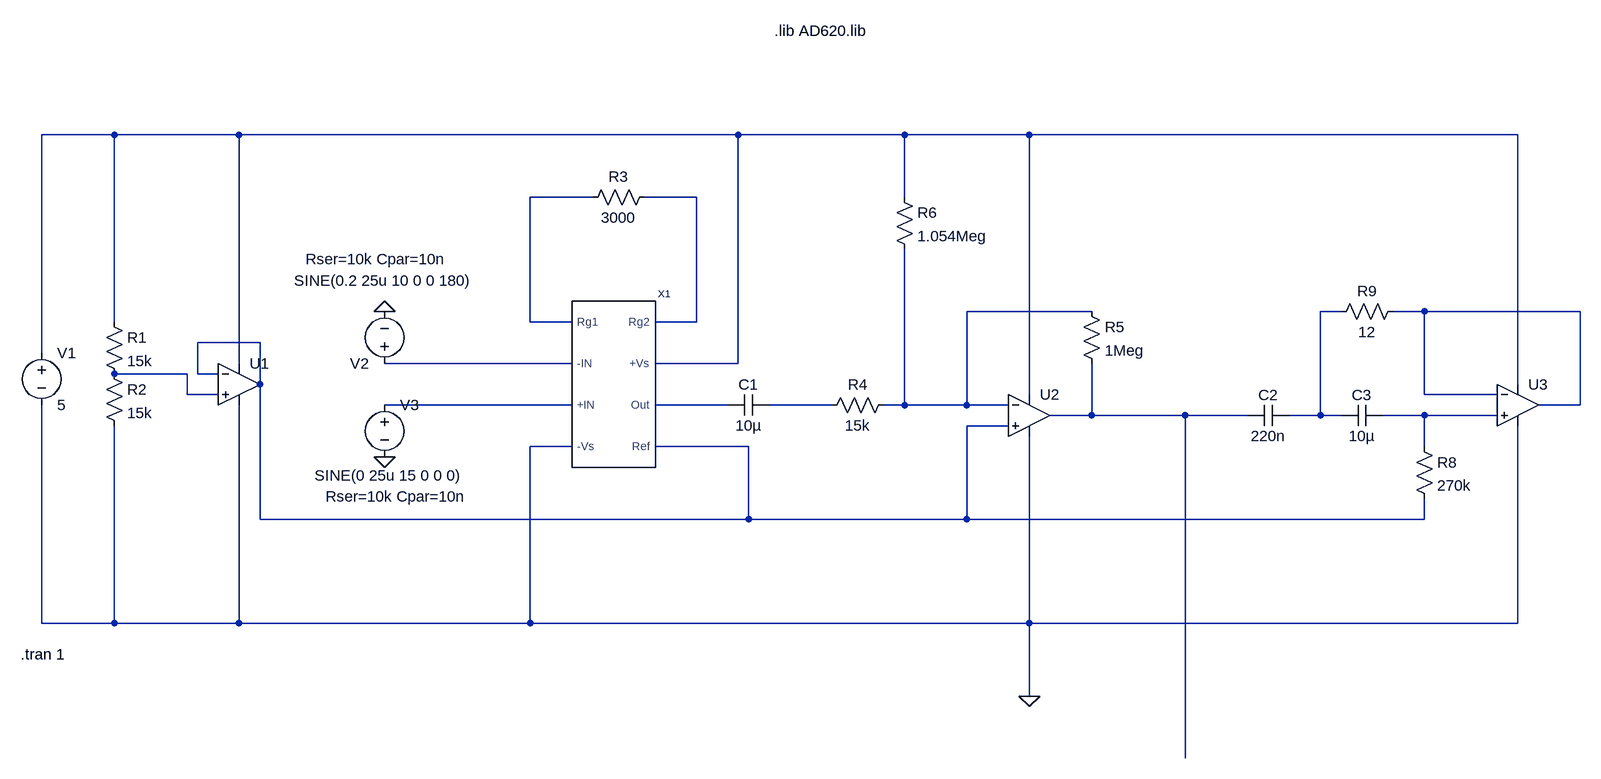
[diagram p0: schematic EEG.asc]
EEG.asc, the LTspice schematic file:
Version 4.1
SHEET 1 2612 752
WIRE 48 -240 -64 -240
WIRE 240 -240 48 -240
WIRE 1008 -240 240 -240
WIRE 1264 -240 1008 -240
WIRE 1456 -240 1264 -240
WIRE 2208 -240 1456 -240
WIRE 784 -144 688 -144
WIRE 944 -144 864 -144
WIRE 1264 -144 1264 -240
WIRE 1552 32 1360 32
WIRE 1936 32 1904 32
WIRE 2064 32 2016 32
WIRE 2304 32 2064 32
WIRE 48 48 48 -240
WIRE 688 48 688 -144
WIRE 752 48 688 48
WIRE 944 48 944 -144
WIRE 944 48 880 48
WIRE 272 80 176 80
WIRE -64 96 -64 -240
WIRE 240 112 240 -240
WIRE 752 112 464 112
WIRE 1008 112 1008 -240
WIRE 1008 112 880 112
WIRE 160 128 48 128
WIRE 176 128 176 80
WIRE 208 128 176 128
WIRE 272 144 272 80
WIRE 2208 144 2208 -240
WIRE 160 160 160 128
WIRE 208 160 160 160
WIRE 1456 160 1456 -240
WIRE 2064 160 2064 32
WIRE 2176 160 2064 160
WIRE 752 176 464 176
WIRE 992 176 880 176
WIRE 1152 176 1056 176
WIRE 1264 176 1264 -64
WIRE 1264 176 1232 176
WIRE 1360 176 1360 32
WIRE 1360 176 1264 176
WIRE 1424 176 1360 176
WIRE 2304 176 2304 32
WIRE 2304 176 2240 176
WIRE 1552 192 1552 112
WIRE 1552 192 1488 192
WIRE 1696 192 1552 192
WIRE 1792 192 1696 192
WIRE 1904 192 1904 32
WIRE 1904 192 1856 192
WIRE 1936 192 1904 192
WIRE 2064 192 2000 192
WIRE 2176 192 2064 192
WIRE 1424 208 1360 208
WIRE 752 240 688 240
WIRE 1024 240 880 240
WIRE 2064 240 2064 192
WIRE 272 352 272 144
WIRE 1024 352 1024 240
WIRE 1024 352 272 352
WIRE 1360 352 1360 208
WIRE 1360 352 1024 352
WIRE 2064 352 2064 320
WIRE 2064 352 1360 352
WIRE -64 512 -64 176
WIRE 48 512 48 208
WIRE 48 512 -64 512
WIRE 240 512 240 176
WIRE 240 512 48 512
WIRE 688 512 688 240
WIRE 688 512 240 512
WIRE 1456 512 1456 224
WIRE 1456 512 688 512
WIRE 2208 512 2208 208
WIRE 2208 512 1456 512
WIRE 1456 624 1456 512
WIRE 1696 720 1696 192
FLAG 464 32 0
FLAG 464 256 0
FLAG 1456 624 0
SYMBOL res 32 32 R0
SYMATTR InstName R1
SYMATTR Value 15k
SYMBOL res 32 112 R0
SYMATTR InstName R2
SYMATTR Value 15k
SYMBOL OpAmps\\UniversalOpAmp 240 144 R0
SYMATTR InstName U1
SYMBOL voltage -64 80 R0
WINDOW 123 0 0 Left 0
WINDOW 39 24 124 Left 2
SYMATTR InstName V1
SYMATTR Value 5
SYMBOL res 880 -160 R90
WINDOW 0 0 56 VBottom 2
WINDOW 3 32 56 VTop 2
SYMATTR InstName R3
SYMATTR Value 3000
SYMBOL res 1248 160 R90
WINDOW 0 0 56 VBottom 2
WINDOW 3 32 56 VTop 2
SYMATTR InstName R4
SYMATTR Value 15k
SYMBOL OpAmps\\UniversalOpAmp 1456 192 R0
SYMATTR InstName U2
SYMBOL res 1536 16 R0
SYMATTR InstName R5
SYMATTR Value 1Meg
SYMBOL lib\\sym\\Opamps\\AD620 816 144 R0
SYMATTR InstName X1
SYMATTR Prefix X
SYMATTR SpiceModel AD620
SYMBOL cap 1856 176 R90
WINDOW 0 0 32 VBottom 2
WINDOW 3 32 32 VTop 2
SYMATTR InstName C2
SYMATTR Value 220n
SYMBOL cap 2000 176 R90
WINDOW 0 0 32 VBottom 2
WINDOW 3 32 32 VTop 2
SYMATTR InstName C3
SYMATTR Value 10µ
SYMBOL res 2048 224 R0
SYMATTR InstName R8
SYMATTR Value 270k
SYMBOL res 2032 16 R90
WINDOW 0 0 56 VBottom 2
WINDOW 3 32 56 VTop 2
SYMATTR InstName R9
SYMATTR Value 12
SYMBOL OpAmps\\UniversalOpAmp 2208 176 R0
SYMATTR InstName U3
SYMBOL voltage 464 128 R180
WINDOW 3 -135 144 Left 2
WINDOW 123 0 0 Left 0
WINDOW 39 -97 177 Left 2
SYMATTR Value SINE(0.2 25u 10 0 0 180)
SYMATTR SpiceLine Rser=10k Cpar=10n
SYMATTR InstName V2
SYMBOL voltage 464 160 R0
WINDOW 3 -108 124 Left 2
WINDOW 123 0 0 Left 0
WINDOW 39 -91 157 Left 2
SYMATTR Value SINE(0 25u 15 0 0 0)
SYMATTR SpiceLine Rser=10k Cpar=10n
SYMATTR InstName V3
SYMBOL cap 1056 160 R90
WINDOW 0 0 32 VBottom 2
WINDOW 3 32 32 VTop 2
SYMATTR InstName C1
SYMATTR Value 10µ
SYMBOL res 1248 -160 R0
SYMATTR InstName R6
SYMATTR Value 1.054Meg
TEXT 1064 -400 Left 2 !.lib AD620.lib
TEXT -96 560 Left 2 !.tran 1

The netlist it stands for:
* EEG.asc
R1 N001 N009 15k
R2 N009 0 15k
X§U1 N009 N007 N001 0 N007 level1 Avol=1Meg GBW=10Meg Vos=0 En=0 Enk=0 In=0 Ink=0 Rin=500Meg  ; pins In+ In- V+ V- OUT
V1 N001 0 5
R3 N003 N002 3000
R4 N004 N012 15k
X§U2 N007 N004 N001 0 N013 level1 Avol=1Meg GBW=10Meg Vos=0 En=0 Enk=0 In=0 Ink=0 Rin=500Meg  ; pins In+ In- V+ V- OUT
R5 N004 N013 1Meg
X§X1 N010 N008 N001 0 N011 N007 N002 N003 AD620  ; pins +IN -IN +Vs -Vs Out Ref Rg1 Rg2
C2 N005 N013 220n
C3 N014 N005 10µ
R8 N014 N007 270k
R9 N006 N005 12
X§U3 N014 N006 N001 0 N006 level1 Avol=1Meg GBW=10Meg Vos=0 En=0 Enk=0 In=0 Ink=0 Rin=500Meg  ; pins In+ In- V+ V- OUT
V2 N008 0 SINE(0.2 25u 10 0 0 180) Rser=10k Cpar=10n
V3 N010 0 SINE(0 25u 15 0 0 0) Rser=10k Cpar=10n
C1 N012 N011 10µ
R6 N001 N004 1.054Meg
.lib AD620.lib
.tran 1
.lib UniversalOpAmp1.lib
.backanno
.end